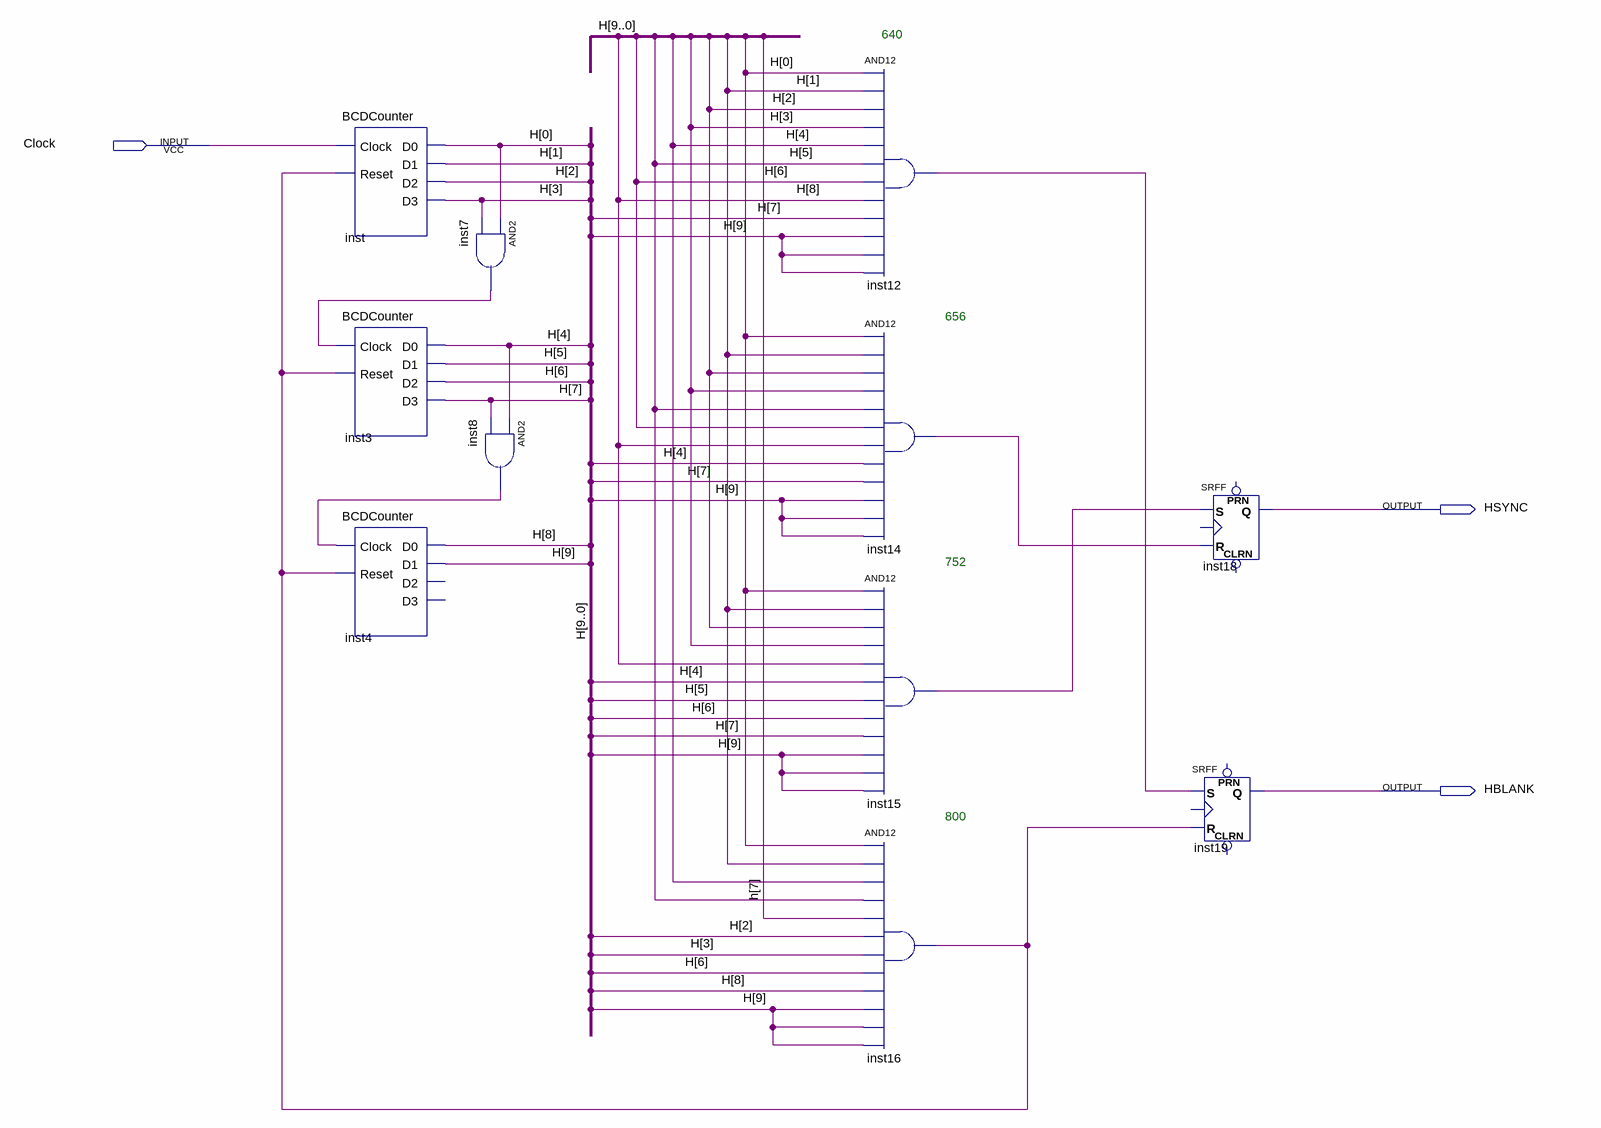
[diagram p0: schematic sheet]
// Quartus schematic HORIZONTALTIMING.bdf as structural Verilog: 11 symbols, 3 pins
module HORIZONTALTIMING (
  input  Clock,
  output HSYNC,
  output HBLANK
);

  wire inst7_out, inst8_out, inst12_out, inst14_out, inst15_out, inst16_out;
  wire [9:0] H;

  BCDCounter inst (.Reset(inst16_out), .Clock(Clock), .D0(H[0]), .D1(H[1]), .D2(H[2]), .D3(H[3]));
  BCDCounter inst3 (.Reset(inst16_out), .Clock(inst7_out), .D0(H[4]), .D1(H[5]), .D2(H[6]), .D3(H[7]));
  BCDCounter inst4 (.Reset(inst16_out), .Clock(inst8_out), .D0(H[8]), .D1(H[9]));  // open: D2, D3
  and inst7 (inst7_out, H[0], H[3]);
  and inst8 (inst8_out, H[4], H[7]);
  and inst12 (inst12_out, H[0], H[1], H[2], H[3], H[4], H[5], H[6], H[8], H[7], H[9], H[9], H[9]);
  and inst14 (inst14_out, H[0], H[1], H[2], H[3], H[5], H[6], H[8], H[4], H[7], H[9], H[9], H[9]);
  and inst15 (inst15_out, H[0], H[1], H[2], H[3], H[8], H[4], H[5], H[6], H[7], H[9], H[9], H[9]);
  and inst16 (inst16_out, H[0], H[1], H[4], H[5], H[7], H[2], H[3], H[6], H[8], H[9], H[9], H[9]);
  SRFF inst18 (.S(inst15_out), .R(inst14_out), .Q(HSYNC));  // open: PRN, CLRN, CLK
  SRFF inst19 (.S(inst12_out), .R(inst16_out), .Q(HBLANK));  // open: PRN, CLRN, CLK

  // Notes on the sheet:
  //   640
  //   656
  //   752
  //   800
endmodule
